# EAGLE design RGB_Bike_POV_v3 (EAGLE 6.1)

## Sheet 1 of 2
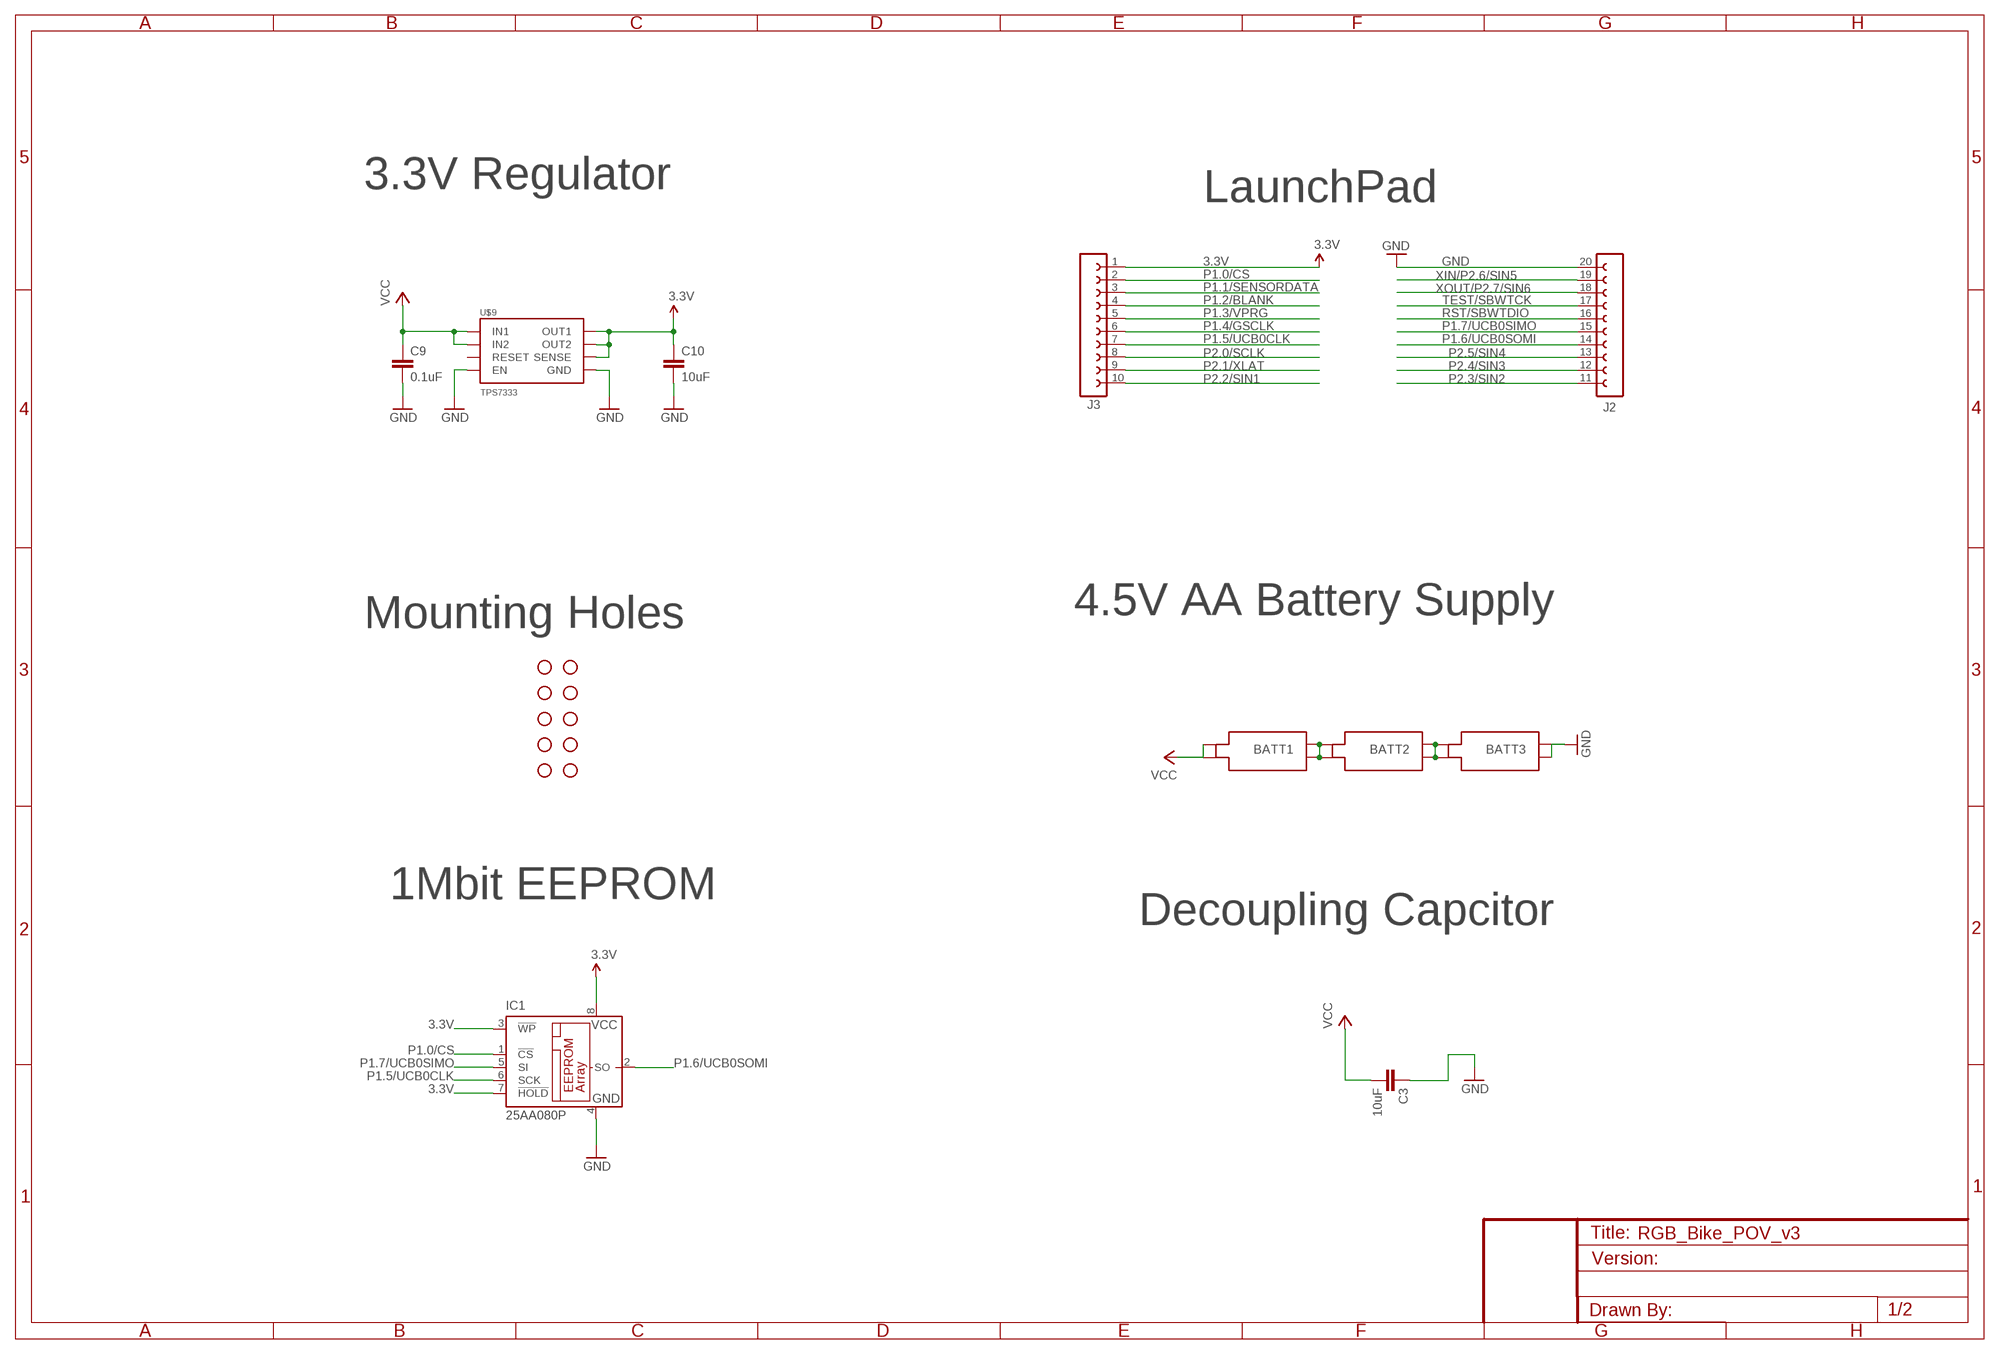
[diagram p0: schematic, sheet 1]

### Parts
BATT1  1XAA  [1XAA]
BATT2  1XAA  [1XAA]
BATT3  1XAA  [1XAA]
C3  10uF  CAPPTH  [CAP-PTH-SMALL]
C9  0.1uF  CAPPTH  [CAP-PTH-SMALL]
C10  10uF  CAPPTH  [CAP-PTH-SMALL]
IC1  25AA080P  [DIL8]
J2  FE10H  [FE10H]
J3  FE10L  [FE10]
JP1  STAND-OFF  [STAND-OFF]
JP2  STAND-OFF  [STAND-OFF]
JP3  STAND-OFF  [STAND-OFF]
JP4  STAND-OFF  [STAND-OFF]
JP5  STAND-OFF  [STAND-OFF]
JP7  STAND-OFF  [STAND-OFF]
JP25  STAND-OFF  [STAND-OFF]
JP26  STAND-OFF  [STAND-OFF]
JP27  STAND-OFF  [STAND-OFF]
JP28  STAND-OFF  [STAND-OFF]
U$9  TPS7333  [TPS7333]

### Nets
3.3V: C10.1 IC1.3(!WP) IC1.7(!HOLD) IC1.8(VCC) J3.1 U$9.5(OUT1) U$9.6(OUT2) U$9.7(SENSE) ; also sheet 2
GND: BATT3.N1 BATT3.N2 C3.1 C9.2 C10.2 IC1.4(GND) J2.20 U$9.1(GND) U$9.2(EN) ; also sheet 2
N$21: BATT1.N1 BATT1.N2 BATT2.P1 BATT2.P2
N$22: BATT2.N1 BATT2.N2 BATT3.P1 BATT3.P2
P1.0/CS: IC1.1(!CS) J3.2
P1.1/SENSORDATA: J3.3 ; also sheet 2
P1.2/BLANK: J3.4 ; also sheet 2
P1.3/VPRG: J3.5 ; also sheet 2
P1.4/GSCLK: J3.6 ; also sheet 2
P1.5/UCB0CLK: IC1.6(SCK) J3.7
P1.6/UCB0SOMI: IC1.2(SO) J2.14
P1.7/UCB0SIMO: IC1.5(SI) J2.15
P2.0/SCLK: J3.8 ; also sheet 2
P2.1/XLAT: J3.9 ; also sheet 2
P2.2/SIN1: J3.10 ; also sheet 2
P2.3/SIN2: J2.11 ; also sheet 2
P2.4/SIN3: J2.12 ; also sheet 2
P2.5/SIN4: J2.13 ; also sheet 2
RST/SBWTDIO: J2.16
TEST/SBWTCK: J2.17
VCC: BATT1.P1 BATT1.P2 C3.2 C9.1 U$9.3(IN1) U$9.4(IN2) ; also sheet 2
XIN/P2.6/SIN5: J2.19 ; also sheet 2
XOUT/P2.7/SIN6: J2.18 ; also sheet 2
Unconnected: U$9.8(RESET)

### Notes on the sheet
- 3.3V Regulator | LaunchPad
- Mounting Holes | 4.5V AA Battery Supply
- 1Mbit EEPROM
- Decoupling Capcitor

## Sheet 2 of 2
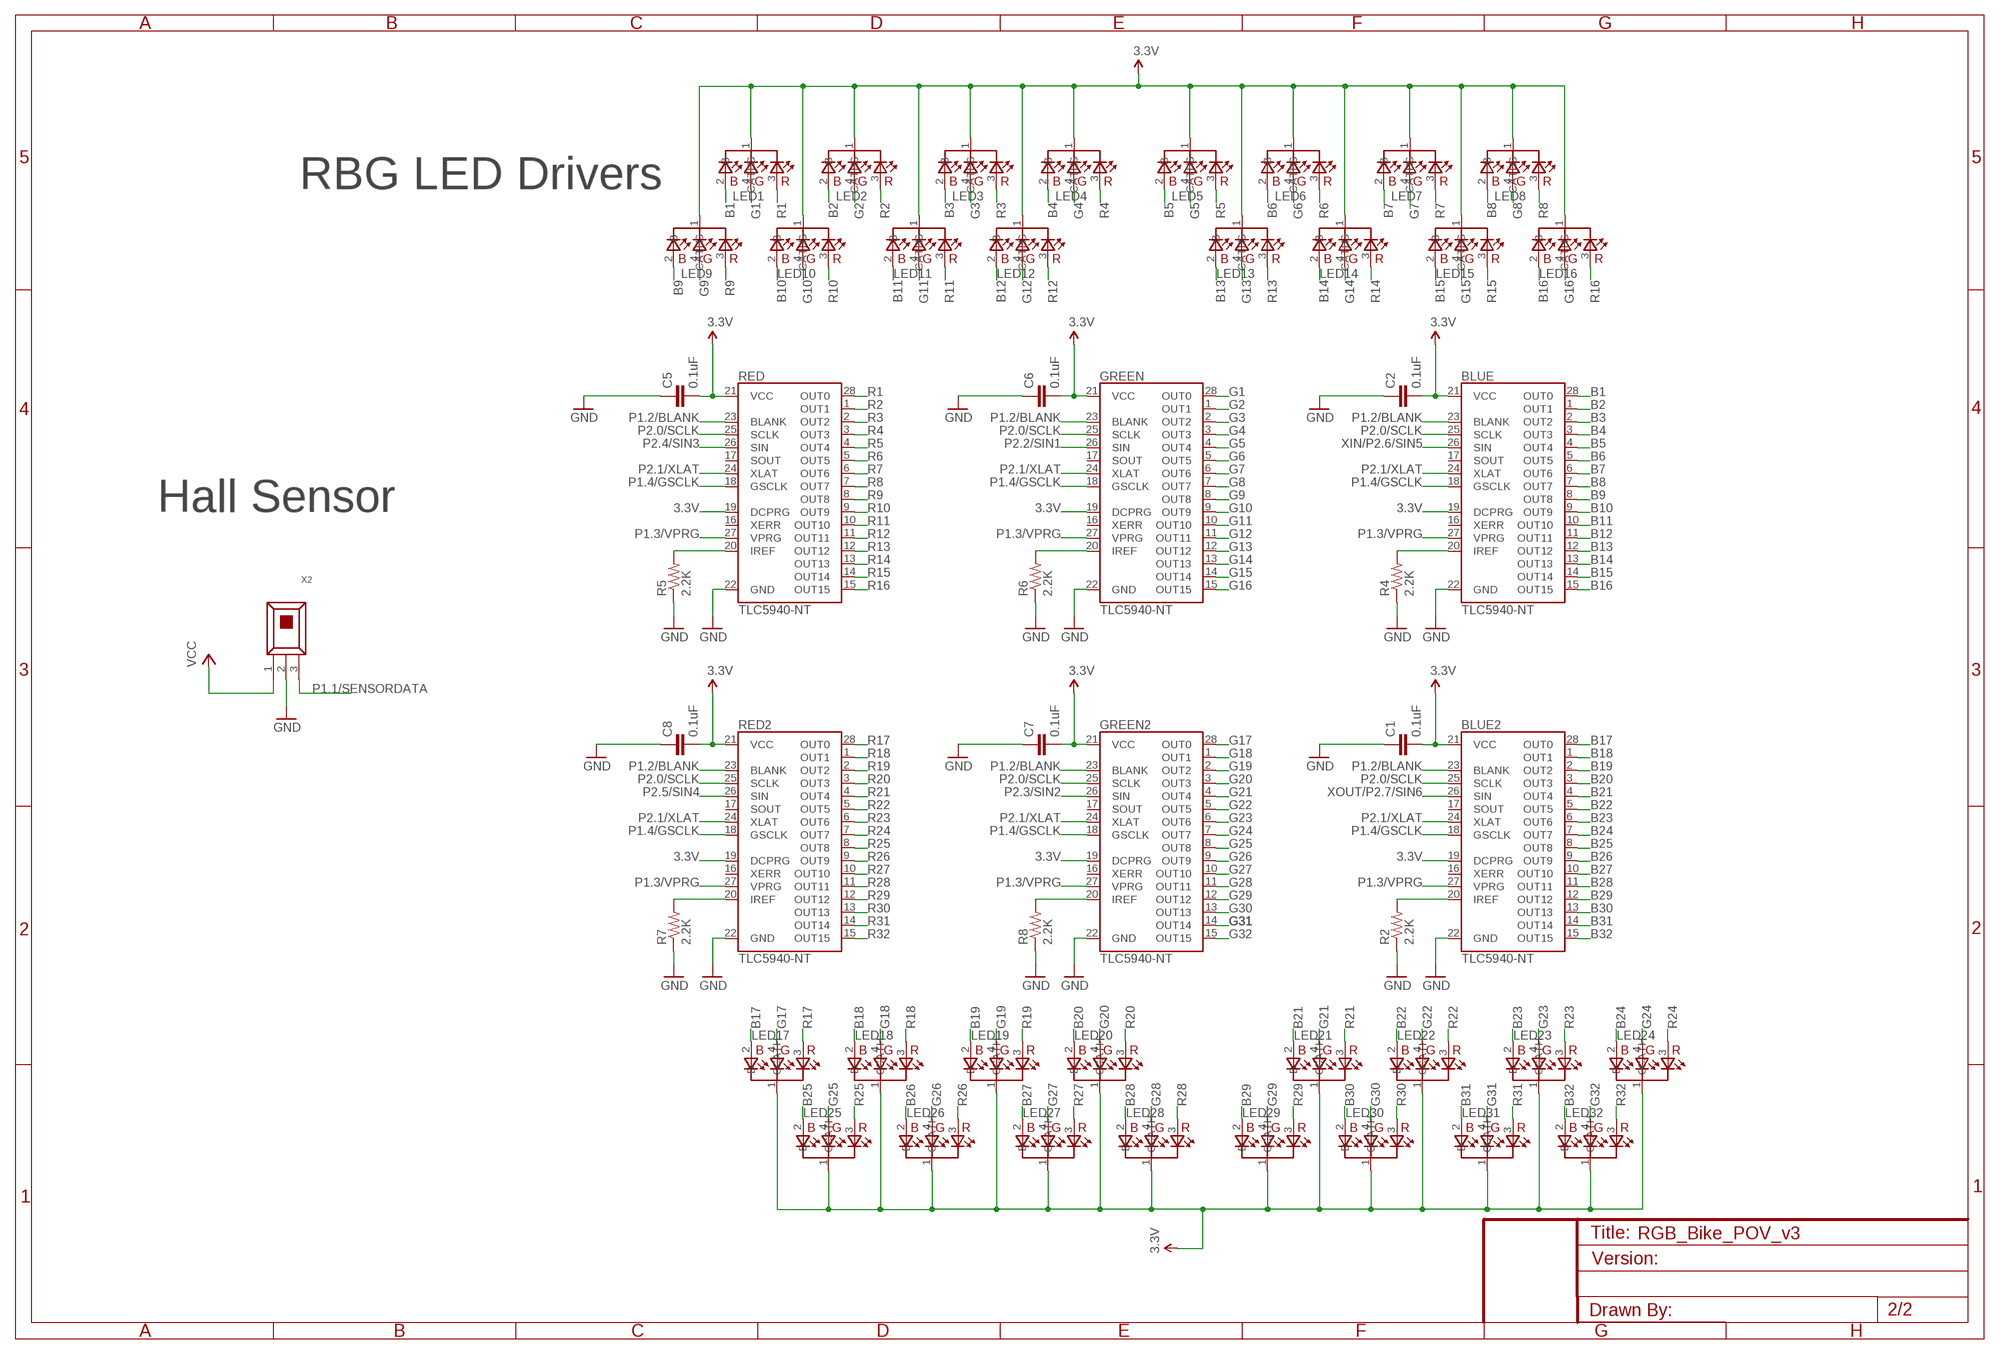
[diagram p1: schematic, sheet 2]

### Parts
BLUE  TLC5940-NT  [DIL28-3]
BLUE2  TLC5940-NT  [DIL28-3]
C1  0.1uF  CAPPTH  [CAP-PTH-SMALL]
C2  0.1uF  CAPPTH  [CAP-PTH-SMALL]
C5  0.1uF  CAPPTH  [CAP-PTH-SMALL]
C6  0.1uF  CAPPTH  [CAP-PTH-SMALL]
C7  0.1uF  CAPPTH  [CAP-PTH-SMALL]
C8  0.1uF  CAPPTH  [CAP-PTH-SMALL]
GREEN  TLC5940-NT  [DIL28-3]
GREEN2  TLC5940-NT  [DIL28-3]
LED1  LED_SUPERFLUX_RGB_CATH  [LED_SUPERFLUX]
LED2  LED_SUPERFLUX_RGB_CATH  [LED_SUPERFLUX]
LED3  LED_SUPERFLUX_RGB_CATH  [LED_SUPERFLUX]
LED4  LED_SUPERFLUX_RGB_CATH  [LED_SUPERFLUX]
LED5  LED_SUPERFLUX_RGB_CATH  [LED_SUPERFLUX]
LED6  LED_SUPERFLUX_RGB_CATH  [LED_SUPERFLUX]
LED7  LED_SUPERFLUX_RGB_CATH  [LED_SUPERFLUX]
LED8  LED_SUPERFLUX_RGB_CATH  [LED_SUPERFLUX]
LED9  LED_SUPERFLUX_RGB_CATH  [LED_SUPERFLUX]
LED10  LED_SUPERFLUX_RGB_CATH  [LED_SUPERFLUX]
LED11  LED_SUPERFLUX_RGB_CATH  [LED_SUPERFLUX]
LED12  LED_SUPERFLUX_RGB_CATH  [LED_SUPERFLUX]
LED13  LED_SUPERFLUX_RGB_CATH  [LED_SUPERFLUX]
LED14  LED_SUPERFLUX_RGB_CATH  [LED_SUPERFLUX]
LED15  LED_SUPERFLUX_RGB_CATH  [LED_SUPERFLUX]
LED16  LED_SUPERFLUX_RGB_CATH  [LED_SUPERFLUX]
LED17  LED_SUPERFLUX_RGB_CATH  [LED_SUPERFLUX]
LED18  LED_SUPERFLUX_RGB_CATH  [LED_SUPERFLUX]
LED19  LED_SUPERFLUX_RGB_CATH  [LED_SUPERFLUX]
LED20  LED_SUPERFLUX_RGB_CATH  [LED_SUPERFLUX]
LED21  LED_SUPERFLUX_RGB_CATH  [LED_SUPERFLUX]
LED22  LED_SUPERFLUX_RGB_CATH  [LED_SUPERFLUX]
LED23  LED_SUPERFLUX_RGB_CATH  [LED_SUPERFLUX]
LED24  LED_SUPERFLUX_RGB_CATH  [LED_SUPERFLUX]
LED25  LED_SUPERFLUX_RGB_CATH  [LED_SUPERFLUX]
LED26  LED_SUPERFLUX_RGB_CATH  [LED_SUPERFLUX]
LED27  LED_SUPERFLUX_RGB_CATH  [LED_SUPERFLUX]
LED28  LED_SUPERFLUX_RGB_CATH  [LED_SUPERFLUX]
LED29  LED_SUPERFLUX_RGB_CATH  [LED_SUPERFLUX]
LED30  LED_SUPERFLUX_RGB_CATH  [LED_SUPERFLUX]
LED31  LED_SUPERFLUX_RGB_CATH  [LED_SUPERFLUX]
LED32  LED_SUPERFLUX_RGB_CATH  [LED_SUPERFLUX]
R2  2.2K  RESISTORPTH-1/6W  [1/6W-RES]
R4  2.2K  RESISTORPTH-1/6W  [1/6W-RES]
R5  2.2K  RESISTORPTH-1/6W  [1/6W-RES]
R6  2.2K  RESISTORPTH-1/6W  [1/6W-RES]
R7  2.2K  RESISTORPTH-1/6W  [1/6W-RES]
R8  2.2K  RESISTORPTH-1/6W  [1/6W-RES]
RED  TLC5940-NT  [DIL28-3]
RED2  TLC5940-NT  [DIL28-3]
X2  HALLEFFECT  [3SIP]

### Nets
3.3V: BLUE2.19(DCPRG) BLUE2.21(VCC) BLUE.19(DCPRG) BLUE.21(VCC) C1.2 C2.2 C5.2 C6.2 C7.2 C8.2 GREEN2.19(DCPRG) GREEN2.21(VCC) GREEN.19(DCPRG) GREEN.21(VCC) LED1.1(CATH) LED2.1(CATH) LED3.1(CATH) LED4.1(CATH) LED5.1(CATH) LED6.1(CATH) LED7.1(CATH) LED8.1(CATH) LED9.1(CATH) LED10.1(CATH) LED11.1(CATH) LED12.1(CATH) LED13.1(CATH) LED14.1(CATH) LED15.1(CATH) LED16.1(CATH) LED17.1(CATH) LED18.1(CATH) LED19.1(CATH) LED20.1(CATH) LED21.1(CATH) LED22.1(CATH) LED23.1(CATH) LED24.1(CATH) LED25.1(CATH) LED26.1(CATH) LED27.1(CATH) LED28.1(CATH) LED29.1(CATH) LED30.1(CATH) LED31.1(CATH) LED32.1(CATH) RED2.19(DCPRG) RED2.21(VCC) RED.19(DCPRG) RED.21(VCC) ; also sheet 1
B1: BLUE.28(OUT0) LED1.2(B)
B2: BLUE.1(OUT1) LED2.2(B)
B3: BLUE.2(OUT2) LED3.2(B)
B4: BLUE.3(OUT3) LED4.2(B)
B5: BLUE.4(OUT4) LED5.2(B)
B6: BLUE.5(OUT5) LED6.2(B)
B7: BLUE.6(OUT6) LED7.2(B)
B8: BLUE.7(OUT7) LED8.2(B)
B9: BLUE.8(OUT8) LED9.2(B)
B10: BLUE.9(OUT9) LED10.2(B)
B11: BLUE.10(OUT10) LED11.2(B)
B12: BLUE.11(OUT11) LED12.2(B)
B13: BLUE.12(OUT12) LED13.2(B)
B14: BLUE.13(OUT13) LED14.2(B)
B15: BLUE.14(OUT14) LED15.2(B)
B16: BLUE.15(OUT15) LED16.2(B)
B17: BLUE2.28(OUT0) LED17.2(B)
B18: BLUE2.1(OUT1) LED18.2(B)
B19: BLUE2.2(OUT2) LED19.2(B)
B20: BLUE2.3(OUT3) LED20.2(B)
B21: BLUE2.4(OUT4) LED21.2(B)
B22: BLUE2.5(OUT5) LED22.2(B)
B23: BLUE2.6(OUT6) LED23.2(B)
B24: BLUE2.7(OUT7) LED24.2(B)
B25: BLUE2.8(OUT8) LED25.2(B)
B26: BLUE2.9(OUT9) LED26.2(B)
B27: BLUE2.10(OUT10) LED27.2(B)
B28: BLUE2.11(OUT11) LED28.2(B)
B29: BLUE2.12(OUT12) LED29.2(B)
B30: BLUE2.13(OUT13) LED30.2(B)
B31: BLUE2.14(OUT14) LED31.2(B)
B32: BLUE2.15(OUT15) LED32.2(B)
G1: GREEN.28(OUT0) LED1.4(G)
G2: GREEN.1(OUT1) LED2.4(G)
G3: GREEN.2(OUT2) LED3.4(G)
G4: GREEN.3(OUT3) LED4.4(G)
G5: GREEN.4(OUT4) LED5.4(G)
G6: GREEN.5(OUT5) LED6.4(G)
G7: GREEN.6(OUT6) LED7.4(G)
G8: GREEN.7(OUT7) LED8.4(G)
G9: GREEN.8(OUT8) LED9.4(G)
G10: GREEN.9(OUT9) LED10.4(G)
G11: GREEN.10(OUT10) LED11.4(G)
G12: GREEN.11(OUT11) LED12.4(G)
G13: GREEN.12(OUT12) LED13.4(G)
G14: GREEN.13(OUT13) LED14.4(G)
G15: GREEN.14(OUT14) LED15.4(G)
G16: GREEN.15(OUT15) LED16.4(G)
G17: GREEN2.28(OUT0) LED17.4(G)
G18: GREEN2.1(OUT1) LED18.4(G)
G19: GREEN2.2(OUT2) LED19.4(G)
G20: GREEN2.3(OUT3) LED20.4(G)
G21: GREEN2.4(OUT4) LED21.4(G)
G22: GREEN2.5(OUT5) LED22.4(G)
G23: GREEN2.6(OUT6) LED23.4(G)
G24: GREEN2.7(OUT7) LED24.4(G)
G25: GREEN2.8(OUT8) LED25.4(G)
G26: GREEN2.9(OUT9) LED26.4(G)
G27: GREEN2.10(OUT10) LED27.4(G)
G28: GREEN2.11(OUT11) LED28.4(G)
G29: GREEN2.12(OUT12) LED29.4(G)
G30: GREEN2.13(OUT13) LED30.4(G)
G31: GREEN2.14(OUT14) LED31.4(G)
G32: GREEN2.15(OUT15) LED32.4(G)
GND: BLUE2.22(GND) BLUE.22(GND) C1.1 C2.1 C5.1 C6.1 C7.1 C8.1 GREEN2.22(GND) GREEN.22(GND) R2.1 R4.1 R5.1 R6.1 R7.1 R8.1 RED2.22(GND) RED.22(GND) X2.2 ; also sheet 1
N$18: BLUE2.20(IREF) R2.2
N$58: BLUE.20(IREF) R4.2
N$77: R5.2 RED.20(IREF)
N$96: GREEN.20(IREF) R6.2
N$115: R7.2 RED2.20(IREF)
N$134: GREEN2.20(IREF) R8.2
P1.1/SENSORDATA: X2.3 ; also sheet 1
P1.2/BLANK: BLUE2.23(BLANK) BLUE.23(BLANK) GREEN2.23(BLANK) GREEN.23(BLANK) RED2.23(BLANK) RED.23(BLANK) ; also sheet 1
P1.3/VPRG: BLUE2.27(VPRG) BLUE.27(VPRG) GREEN2.27(VPRG) GREEN.27(VPRG) RED2.27(VPRG) RED.27(VPRG) ; also sheet 1
P1.4/GSCLK: BLUE2.18(GSCLK) BLUE.18(GSCLK) GREEN2.18(GSCLK) GREEN.18(GSCLK) RED2.18(GSCLK) RED.18(GSCLK) ; also sheet 1
P2.0/SCLK: BLUE2.25(SCLK) BLUE.25(SCLK) GREEN2.25(SCLK) GREEN.25(SCLK) RED2.25(SCLK) RED.25(SCLK) ; also sheet 1
P2.1/XLAT: BLUE2.24(XLAT) BLUE.24(XLAT) GREEN2.24(XLAT) GREEN.24(XLAT) RED2.24(XLAT) RED.24(XLAT) ; also sheet 1
P2.2/SIN1: GREEN.26(SIN) ; also sheet 1
P2.3/SIN2: GREEN2.26(SIN) ; also sheet 1
P2.4/SIN3: RED.26(SIN) ; also sheet 1
P2.5/SIN4: RED2.26(SIN) ; also sheet 1
R1: LED1.3(R) RED.28(OUT0)
R2: LED2.3(R) RED.1(OUT1)
R3: LED3.3(R) RED.2(OUT2)
R4: LED4.3(R) RED.3(OUT3)
R5: LED5.3(R) RED.4(OUT4)
R6: LED6.3(R) RED.5(OUT5)
R7: LED7.3(R) RED.6(OUT6)
R8: LED8.3(R) RED.7(OUT7)
R9: LED9.3(R) RED.8(OUT8)
R10: LED10.3(R) RED.9(OUT9)
R11: LED11.3(R) RED.10(OUT10)
R12: LED12.3(R) RED.11(OUT11)
R13: LED13.3(R) RED.12(OUT12)
R14: LED14.3(R) RED.13(OUT13)
R15: LED15.3(R) RED.14(OUT14)
R16: LED16.3(R) RED.15(OUT15)
R17: LED17.3(R) RED2.28(OUT0)
R18: LED18.3(R) RED2.1(OUT1)
R19: LED19.3(R) RED2.2(OUT2)
R20: LED20.3(R) RED2.3(OUT3)
R21: LED21.3(R) RED2.4(OUT4)
R22: LED22.3(R) RED2.5(OUT5)
R23: LED23.3(R) RED2.6(OUT6)
R24: LED24.3(R) RED2.7(OUT7)
R25: LED25.3(R) RED2.8(OUT8)
R26: LED26.3(R) RED2.9(OUT9)
R27: LED27.3(R) RED2.10(OUT10)
R28: LED28.3(R) RED2.11(OUT11)
R29: LED29.3(R) RED2.12(OUT12)
R30: LED30.3(R) RED2.13(OUT13)
R31: LED31.3(R) RED2.14(OUT14)
R32: LED32.3(R) RED2.15(OUT15)
VCC: X2.1 ; also sheet 1
XIN/P2.6/SIN5: BLUE.26(SIN) ; also sheet 1
XOUT/P2.7/SIN6: BLUE2.26(SIN) ; also sheet 1
Unconnected: BLUE2.16(XERR) BLUE2.17(SOUT) BLUE.16(XERR) BLUE.17(SOUT) GREEN2.16(XERR) GREEN2.17(SOUT) GREEN.16(XERR) GREEN.17(SOUT) RED2.16(XERR) RED2.17(SOUT) RED.16(XERR) RED.17(SOUT)

### Notes on the sheet
- RBG LED Drivers
- Hall Sensor

## Library data of the parts
BATT1-BATT3 = dorky:1XAA
BLUE BLUE2 GREEN GREEN2 RED RED2 = SparkFun:TLC5940: TI TLC5940 16-channel LED Driver with Dot Correction and Grayscale PWM Control The TLC5940 is a 16-channel, constant-current sink LED driver. Each channel has an individually adjustable 4096-step grayscale PWM brightness control and a 64-step, constant-current sink (dot correction). The dot correction adjusts the brightness variations between LED channels and other LED drivers. The dot correction data is stored in an integrated EEPROM. Both grayscale control and dot correction are accessible via a serial interface. A single external resistor sets the maximum current value of all 16 channels. Packages: 28-pin HTSSOP 32-pin 5x5mm QFN 28-pin DIP
C1-C3 C5-C10 = SparkFun:CAP: Capacitor Standard 0603 ceramic capacitor, and 0.1" leaded capacitor.
IC1 = microchip:25*: Serial EEPROM 4K/ 8K , SPI bus; MF: MICROCHIP; MPN: 25AA080/P; OC_FARNELL: 1331352; OC_NEWARK: 92C7349
J2 = sMSP430:FE10H
J3 = sMSP430:FE10L
JP1-JP5 JP7 JP25-JP28 = SparkFun:STAND-OFF: Stand Off This is the mechanical footprint for a #4 phillips button head screw. Use the keepout ring to avoid running the screw head into surrounding components. SKU : PRT-00447
LED1-LED32 = hazard:LED_SUPERFLUX_RGB_CATH
R2 R4-R8 = SparkFun:RESISTOR: Resistor Basic schematic elements and footprints for 0603, 1206, and PTH resistors.
U$9 = launchpad_comp:TPS7333
X2 = dorky:HALLEFFECT

## Net classes
0 default: width 0.254 mm
1 Ground: width 0.1 mm, drill 0.2 mm

## Board
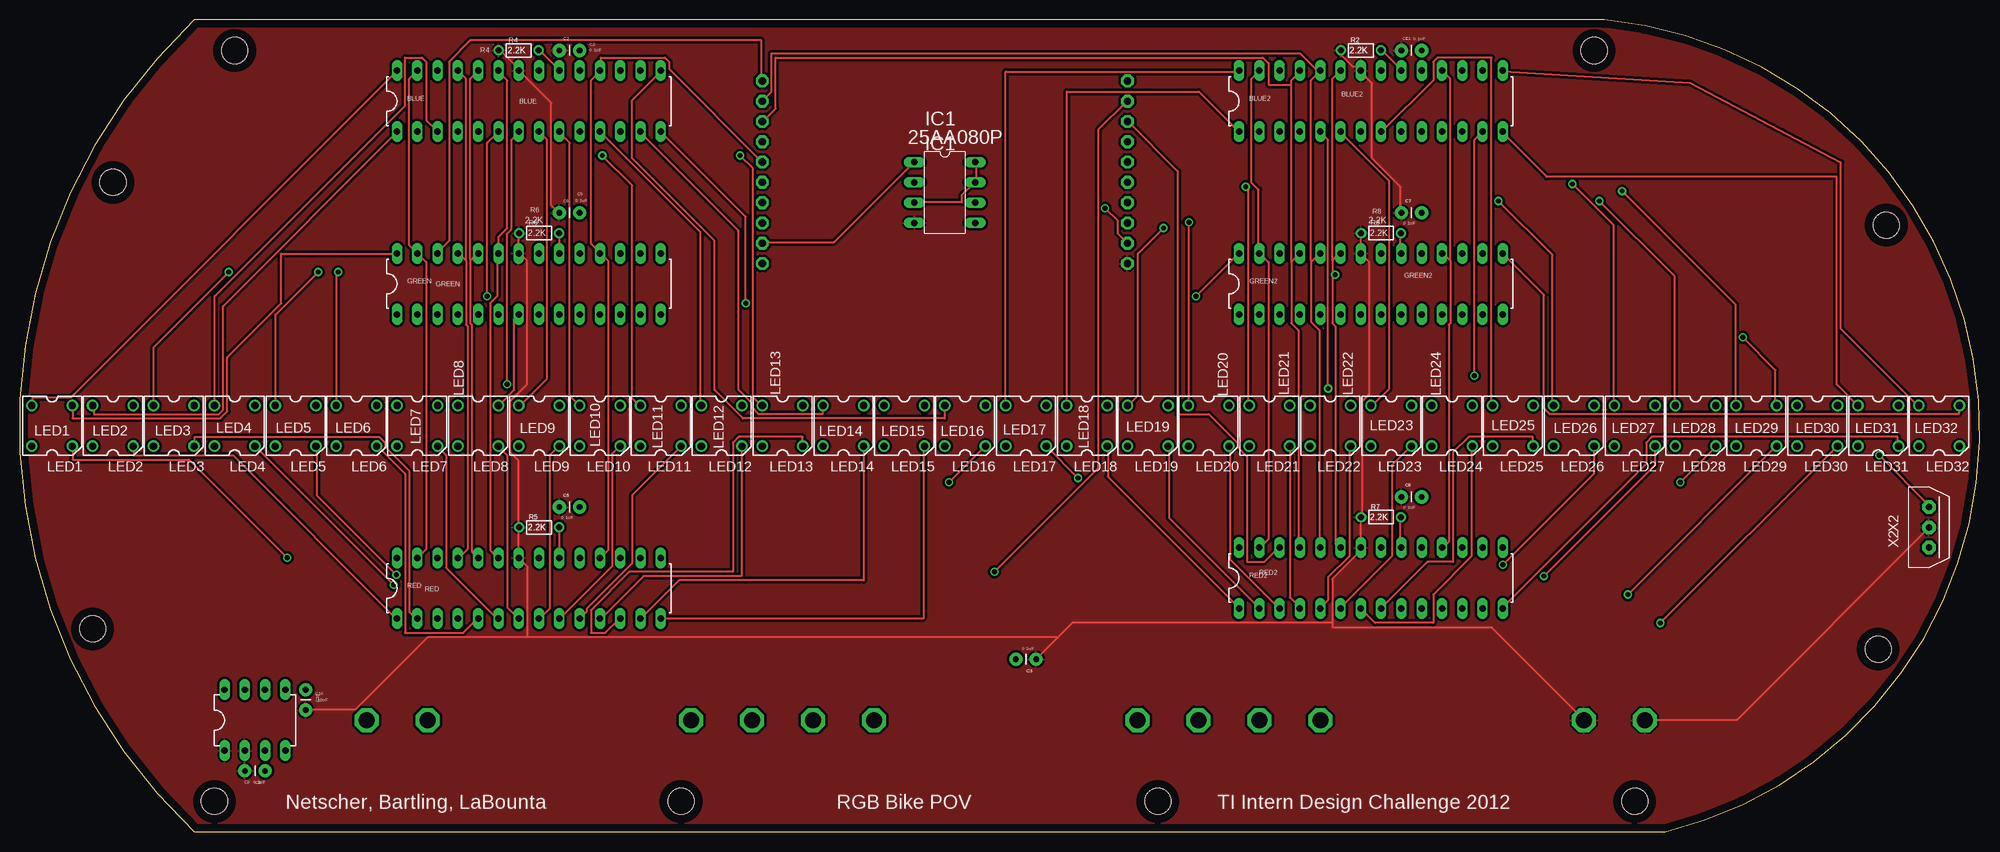
[diagram p2: board, top side]
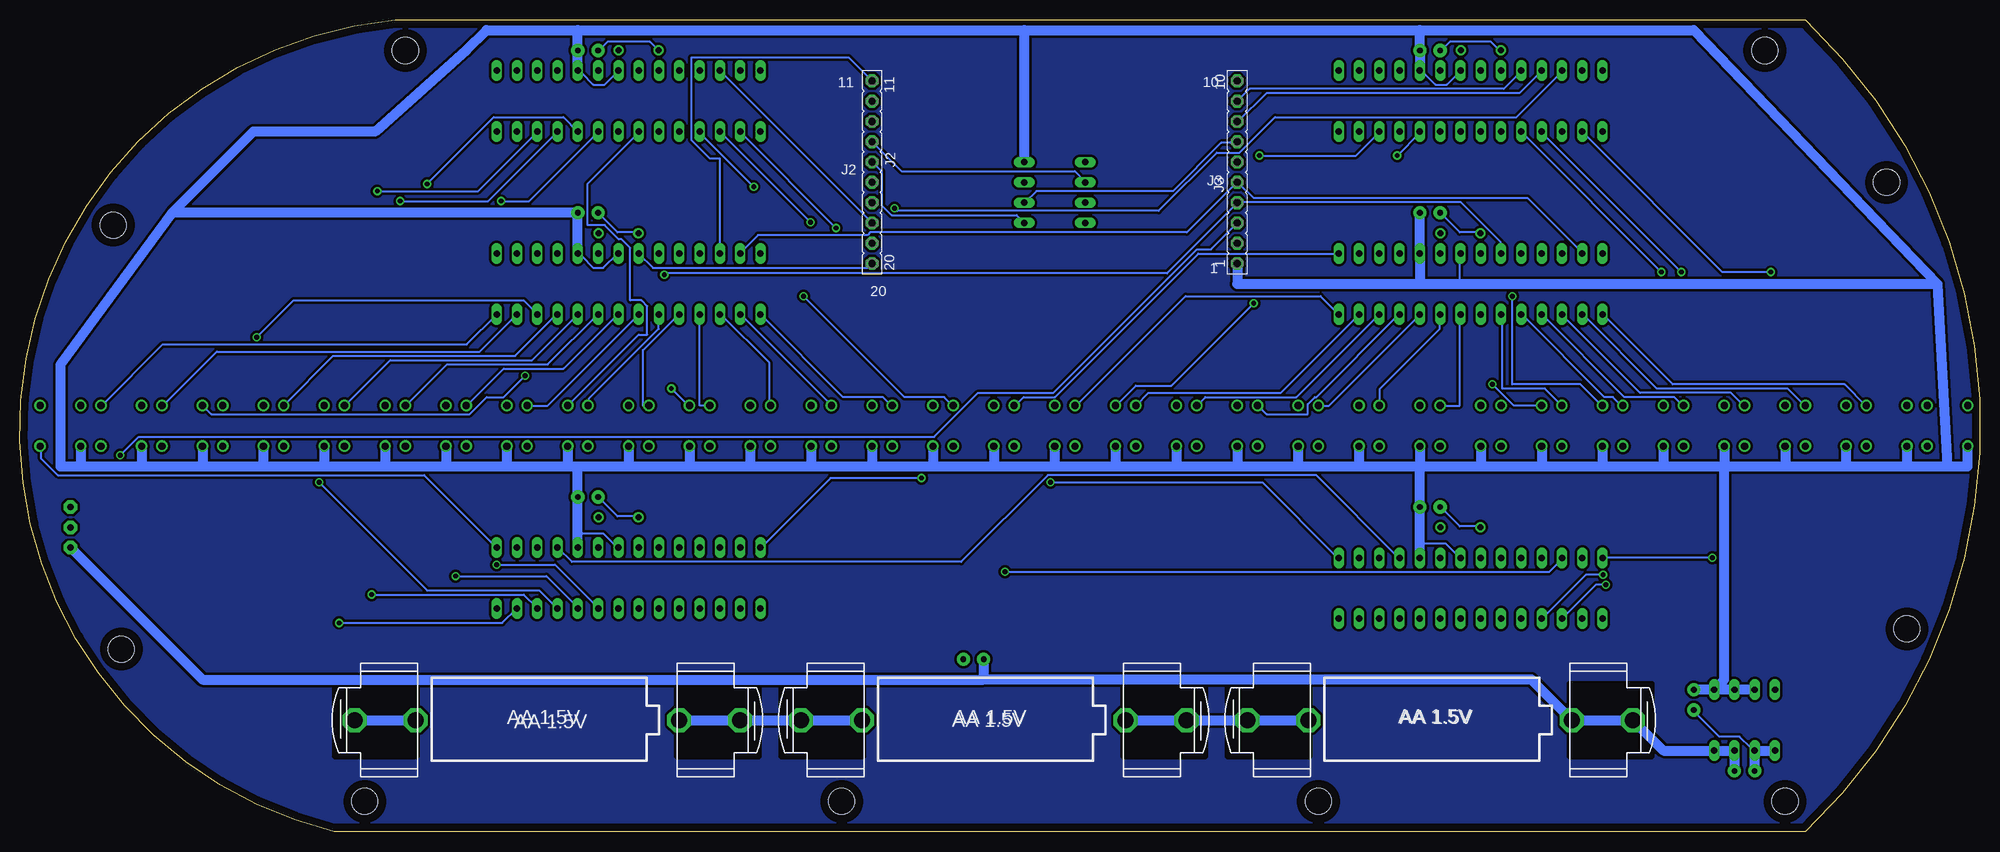
[diagram p3: board, bottom side, seen from below]

Size 245.31 x 101.6 mm. Coordinates in mm from the lower left corner, seen from the top.
Outline: 21.8,0 205.95,0 arc161 198.33,101.6 21.8,101.6 arc93 21.8,0
Copper layers (1*16): Top 0.035mm / dielectric 1.5mm / Bottom 0.035mm
Design rules: minimum track width 10mil, minimum drill 24mil, track to track 8mil, track to pad 8mil, pad to pad 8mil, via to via 8mil, smd to smd 8mil, copper to edge 40mil, drill to drill 8mil, minimum pad ring 10mil, minimum via ring 8mil, stop-mask expansion 4mil, vias tented up to drill 0mil, thermal gap 10mil

### Footprints (pad centres in the part's own frame; a part is rotated, then mirrored left to right if it is on the bottom)
1XAA = drill 2 octagon: N1 -15.24,0; N2 -22.86,0; P1 17.78,0; P2 25.4,0
DIL28-3 = drill 0.813 long: 1 -16.51,-3.81; 2 -13.97,-3.81; 3 -11.43,-3.81; 4 -8.89,-3.81; 5 -6.35,-3.81; 6 -3.81,-3.81; 7 -1.27,-3.81; 8 1.27,-3.81; 9 3.81,-3.81; 10 6.35,-3.81; 11 8.89,-3.81; 12 11.43,-3.81; 13 13.97,-3.81; 14 16.51,-3.81; 15 16.51,3.81; 16 13.97,3.81; 17 11.43,3.81; 18 8.89,3.81; 19 6.35,3.81; 20 3.81,3.81; 21 1.27,3.81; 22 -1.27,3.81; 23 -3.81,3.81; 24 -6.35,3.81; 25 -8.89,3.81; 26 -11.43,3.81; 27 -13.97,3.81; 28 -16.51,3.81
CAP-PTH-SMALL = drill 0.7 pad 1.651: 1 0,0; 2 2.54,0
DIL8 = drill 0.813 long: 1 -3.81,-3.81; 2 -1.27,-3.81; 3 1.27,-3.81; 4 3.81,-3.81; 5 3.81,3.81; 6 1.27,3.81; 7 -1.27,3.81; 8 -3.81,3.81
FE10H = drill 0.914 pad 1.6 octagon: 11 -11.43,0; 12 -8.89,0; 13 -6.35,0; 14 -3.81,0; 15 -1.27,0; 16 1.27,0; 17 3.81,0; 18 6.35,0; 19 8.89,0; 20 11.43,0
FE10 = drill 0.914 pad 1.6 octagon: 1 -11.43,0; 2 -8.89,0; 3 -6.35,0; 4 -3.81,0; 5 -1.27,0; 6 1.27,0; 7 3.81,0; 8 6.35,0; 9 8.89,0; 10 11.43,0
STAND-OFF = hole 3.302: 0,0
LED_SUPERFLUX = drill 0.9 pad 1.422: 1 0,5.08; 2 5.08,5.08; 3 0,0; 4 5.08,0
1/6W-RES = drill 0.762: 1 -2.5,0; 2 2.5,0
TPS7333 = drill 0.8 long: 1 -3.81,3.81; 2 -3.81,1.27; 3 -3.81,-1.27; 4 -3.81,-3.81; 5 3.81,-3.81; 6 3.81,-1.27; 7 3.81,1.27; 8 3.81,3.81
3SIP = drill 0.813 pad 1.676 octagon: 1 -2.54,0; 2 0,0; 3 2.54,0

### Placement (x,y rotation side)
BATT1  68.79,13.97 0 bottom
BATT2  124.67,13.97 0 bottom
BATT3  180.55,13.97 0 bottom
BLUE  63.71,91.44 0 top
BLUE2  169.12,91.44 0 top
C1  172.93,97.79 0 top
C2  67.52,97.79 0 top
C3  127.21,21.59 180 top
C5  67.52,40.64 0 top
C6  67.52,77.47 0 top
C7  172.93,77.47 0 top
C8  172.93,41.91 0 top
C9  30.69,7.62 180 top
C10  35.77,17.78 270 top
GREEN  63.71,68.58 0 top
GREEN2  169.12,68.58 0 top
IC1  115.78,80.01 270 top
J2  138.64,82.55 270 bottom
J3  92.92,82.55 90 bottom
JP1  82.76,3.81 0 top
JP2  24.34,3.81 0 top
JP3  142.45,3.81 0 top
JP4  202.14,3.81 0 top
JP5  26.88,97.79 0 top
JP7  197.06,97.79 0 top
JP25  232.62,22.86 0 top
JP26  11.64,81.28 0 top
JP27  9.1,25.4 0 top
JP28  233.63,75.92 0 top
LED1  6.56,48.26 90 top
LED2  14.18,48.26 90 top
LED3  21.8,48.26 90 top
LED4  29.42,48.26 90 top
LED5  37.04,48.26 90 top
LED6  44.66,48.26 90 top
LED7  52.28,48.26 90 top
LED8  59.9,48.26 90 top
LED9  67.52,48.26 90 top
LED10  75.14,48.26 90 top
LED11  82.76,48.26 90 top
LED12  90.38,48.26 90 top
LED13  98,48.26 90 top
LED14  105.62,48.26 90 top
LED15  113.24,48.26 90 top
LED16  120.86,48.26 90 top
LED17  128.48,48.26 90 top
LED18  136.1,48.26 90 top
LED19  143.72,48.26 90 top
LED20  151.34,48.26 90 top
LED21  158.96,48.26 90 top
LED22  166.58,48.26 90 top
LED23  174.2,48.26 90 top
LED24  181.82,48.26 90 top
LED25  189.44,48.26 90 top
LED26  197.06,48.26 90 top
LED27  204.68,48.26 90 top
LED28  212.3,48.26 90 top
LED29  219.92,48.26 90 top
LED30  227.54,48.26 90 top
LED31  235.16,48.26 90 top
LED32  242.78,48.26 90 top
R2  167.85,97.79 0 top
R4  62.44,97.79 0 top
R5  64.98,38.1 0 top
R6  64.98,74.93 0 top
R7  170.39,39.37 0 top
R8  170.39,74.93 0 top
RED  63.71,30.48 0 top
RED2  169.12,31.75 0 top
U$9  29.42,13.97 90 top
X2  238.97,38.1 90 top

### Tracks (layer width: path | path; a pad name or v marks a point on that pad's centre or on a via)
3.3V
  Top 0.254: IC1.3 112.02,78.77 117.89,78.77 117.89,79.65 119.49,81.25 IC1.7 119.66,81.43 119.66,83.74 IC1.8
  Bottom 0.254: 70.06,36.09 66.86,36.09 65.08,34.31 RED.21 | 65.08,68.58 65.08,72.36 GREEN.21 | BLUE.21 65.08,95.12 66.68,93.52 68.1,93.52 69.53,94.94 BLUE.19 | 175.47,37.34 172.29,37.34 170.52,35.56 RED2.21 | GREEN2.21 170.52,72.36 172.29,70.59 173.54,70.59 174.96,72.01 GREEN2.19 | BLUE2.21 172.12,93.52 173.54,93.52 174.96,94.94 BLUE2.19
  Bottom 1.27: U$9.7 U$9.6 U$9.5 | U$9.5 C10.1 | U$9.5 31.96,19.05 31.96,45.72 | 31.96,45.72 24.34,45.72 | 24.34,45.72 16.72,45.72 | 16.72,45.72 9.1,45.72 | 9.1,45.72 4.02,45.72 | 4.02,45.72 1.48,45.72 LED1.1 | LED2.1 9.1,45.72 | LED3.1 16.72,45.72 | LED4.1 24.34,45.72 | LED32.1 237.7,45.72 | 237.7,45.72 230.08,45.72 | 230.08,45.72 222.46,45.72 | 222.46,45.72 214.84,45.72 | 214.84,45.72 207.22,45.72 | 207.22,45.72 199.6,45.72 | 199.6,45.72 191.98,45.72 | 191.98,45.72 184.36,45.72 | 184.36,45.72 176.74,45.72 | 176.74,45.72 175.47,45.72 | 175.47,45.72 169.12,45.72 | 169.12,45.72 161.5,45.72 | 161.5,45.72 153.88,45.72 | 153.88,45.72 146.26,45.72 | 146.26,45.72 138.64,45.72 | 138.64,45.72 131.02,45.72 | 131.02,45.72 123.4,45.72 | 123.4,45.72 115.78,45.72 | 115.78,45.72 108.16,45.72 | 108.16,45.72 100.54,45.72 | 100.54,45.72 92.92,45.72 | 92.92,45.72 85.3,45.72 | 85.3,45.72 77.68,45.72 | 77.68,45.72 70.06,45.72 | 70.06,45.72 62.44,45.72 | 62.44,45.72 54.82,45.72 | 54.82,45.72 47.2,45.72 | 47.2,45.72 39.58,45.72 | 39.58,45.72 31.96,45.72 | LED5.1 31.96,45.72 | LED6.1 39.58,45.72 | LED7.1 47.2,45.72 | LED8.1 54.82,45.72 | LED9.1 62.44,45.72 | LED10.1 70.06,45.72 | LED11.1 77.68,45.72 | LED12.1 85.3,45.72 | LED13.1 92.92,45.72 | LED14.1 100.54,45.72 | LED15.1 108.16,45.72 | LED16.1 115.78,45.72 | LED17.1 123.4,45.72 | LED18.1 131.02,45.72 | LED19.1 138.64,45.72 | LED20.1 146.26,45.72 | LED21.1 153.88,45.72 | LED22.1 161.5,45.72 | LED23.1 169.12,45.72 | LED24.1 176.74,45.72 | LED25.1 184.36,45.72 | LED26.1 191.98,45.72 | LED27.1 199.6,45.72 | LED28.1 207.22,45.72 | LED29.1 214.84,45.72 | LED30.1 222.46,45.72 | LED31.1 230.08,45.72 | RED.19 70.06,36.09 C5.2 70.06,45.72 | C6.2 GREEN.19 70.06,68.58 | RED2.19 175.47,37.34 C8.2 175.47,45.72
  Bottom 1.27: GREEN2.19 C7.2 226.27,77.47 | BLUE.19 C2.2 70.06,100.33 | 119.59,100.33 IC1.8 | 226.27,77.47 240.24,58.42 240.24,45.72 237.7,45.72 | 226.27,77.47 216.11,87.63 200.87,87.63 189.44,97.79 186.9,100.33 175.47,100.33 | BLUE2.19 C1.2 175.47,100.33 | 175.47,100.33 119.59,100.33 | 119.59,100.33 70.06,100.33 | 70.06,100.33 35.77,100.33 5.29,68.58 | 5.29,68.58 4.02,45.72 | 70.06,68.58 65.08,68.58 5.29,68.58 | J3.1 92.92,68.58 70.06,68.58
B1
  Top 0.254: BLUE.28 47.12,95.12 6.41,54.41 1.61,54.41 1.61,53.34 LED1.2
B2
  Top 0.254: BLUE.1 47.12,87.48 25.43,65.79 25.43,52.81 24.9,52.27 9.25,52.27 9.25,53.34 LED2.2
B3  (via drill 0.61)
  Top 0.254: v26.14,70.05 16.72,60.63 LED3.2
  Bottom 0.254: v26.14,70.05 32.19,70.05 49.61,87.48 BLUE.2
B4
  Top 0.254: BLUE.3 52.28,87.66 50.86,89.08 50.86,96.37 50.32,96.9 48.19,96.9 48.19,90.86 24.36,67.03 24.36,53.34 LED4.2
B5  (via drill 0.61)
  Top 0.254: v37.34,70.05 32.01,64.72 32.01,53.34 LED5.2
  Bottom 0.254: v37.34,70.05 54.77,87.48 BLUE.4
B6  (via drill 0.61)
  Top 0.254: v39.83,70.05 39.65,69.88 39.65,53.34 LED6.2
  Bottom 0.254: v39.83,70.05 57.26,87.48 BLUE.5
B7  (via drill 0.61)
  Top 0.254: BLUE.6 58.5,86.23 v58.5,67.03
  Bottom 0.254: v58.5,67.03 58.5,56.01 49.97,56.01 47.3,53.34 LED7.2
B8  (via drill 0.61)
  Top 0.254: v60.99,56.01 60.99,74.85 61.52,75.39 61.52,86.59 62.41,87.48 BLUE.7
  Bottom 0.254: v60.99,56.01 58.32,53.34 LED8.2
B9
  Top 0.254: BLUE.8 65.08,87.48 65.97,86.59 65.97,56.72 62.59,53.34 LED9.2
B10
  Top 0.254: LED10.2 68.81,54.59 68.81,86.23 67.57,87.48 BLUE.9
B11  (via drill 0.61)
  Top 0.254: v72.9,84.63 76.64,80.9 76.64,54.23 77.53,53.34 LED11.2
  Bottom 0.254: v72.9,84.63 70.06,87.48 BLUE.10
B12
  Top 0.254: BLUE.11 72.73,87.48 85.17,75.03 85.17,53.34 LED12.2
B13  (via drill 0.61)
  Top 0.254: v90.15,84.63 91.75,83.03 91.75,54.41 92.82,53.34 LED13.2
  Bottom 0.254: v90.15,84.63 78.06,84.63 75.21,87.48 BLUE.12
B14
  Top 0.254: BLUE.13 77.7,87.48 89.97,75.21 89.97,55.3 91.75,53.52 91.75,52.98 92.46,52.27 100.46,52.27 100.46,53.34 LED14.2
B15  (via drill 0.61)
  Top 0.254: BLUE.14 90.86,76.99 v90.86,66.14
  Bottom 0.254: v90.86,66.14 101.17,55.83 105.62,55.83 108.11,53.34 LED15.2
B16
  Top 0.254: BLUE.15 80.19,95.12 76.64,91.57 76.64,84.28 86.95,73.97 86.95,55.3 90.51,51.74 115.75,51.74 115.75,53.34 LED16.2
B17
  Top 0.254: LED17.2 123.4,95.12 152.56,95.12 BLUE2.28
B18
  Top 0.254: BLUE2.1 152.56,87.66 147.58,92.63 131.04,92.63 131.04,53.34 LED18.2
B19  (via drill 0.61)
  Top 0.254: v143.13,75.56 139.93,72.36 139.93,54.59 138.69,53.34 LED19.2
  Bottom 0.254: v143.13,75.56 155.05,87.48 BLUE2.2
B20  (via drill 0.61)
  Top 0.254: v146.33,76.28 146.33,53.34 LED20.2
  Bottom 0.254: v146.33,76.28 BLUE2.3
B21  (via drill 0.61)
  Top 0.254: v153.45,80.72 153.8,80.37 153.8,53.34 LED21.2
  Bottom 0.254: v153.45,80.72 160.2,87.48 BLUE2.4
B22  (via drill 0.61)
  Top 0.254: v163.76,55.47 163.76,86.59 162.87,87.48 BLUE2.5
  Bottom 0.254: v163.76,55.47 161.63,53.34 LED22.2
B23
  Top 0.254: BLUE2.6 165.36,87.48 171.4,81.43 171.4,55.47 169.27,53.34 LED23.2
B24
  Bottom 0.254: LED24.2 167.85,62.23 166.78,62.23 166.78,65.79 167.49,66.5 168.92,66.5 168.92,73.08 169.98,74.14 170.34,74.14 172.12,75.92 174.25,75.92 174.25,81.08 167.85,87.48 BLUE2.7
B25
  Top 0.254: BLUE2.8 170.52,87.66 176.92,94.06 176.92,96.37 177.45,96.9 184.21,96.9 184.21,53.34 LED25.2
B26  (via drill 0.61)
  Top 0.254: v185.1,78.94 191.85,72.19 191.85,53.34 LED26.2
  Bottom 0.254: v185.1,78.94 181.54,78.94 173,87.48 BLUE2.9
B27  (via drill 0.61)
  Top 0.254: v194.34,81.08 199.5,75.92 199.5,53.34 LED27.2
  Bottom 0.254: BLUE2.10 177.27,89.43 185.98,89.43 v194.34,81.08
B28  (via drill 0.61)
  Top 0.254: v197.72,78.94 207.14,69.52 207.14,53.34 LED28.2
  Bottom 0.254: BLUE2.11 186.7,78.94 v197.72,78.94
B29  (via drill 0.61)
  Top 0.254: v200.56,80.19 214.79,65.96 214.79,53.34 LED29.2
  Bottom 0.254: v200.56,80.19 187.94,80.19 180.65,87.48 BLUE2.12
B30  (via drill 0.61)
  Top 0.254: v182.07,57.07 182.07,86.59 182.96,87.48 BLUE2.13
  Bottom 0.254: v182.07,57.07 184.74,54.41 186.87,54.41 189.01,52.27 221.37,52.27 222.43,53.34 LED30.2
B31
  Top 0.254: LED31.2 227.41,56.01 227.41,81.97 191.14,81.97 185.63,87.48 BLUE2.14
B32
  Top 0.254: BLUE2.15 185.63,95.12 209.1,93.7 227.94,83.74 227.94,62.94 237.55,53.34 LED32.2
G1
  Top 0.254: GREEN.28 47.12,72.36 32.72,72.36 32.72,66.14 25.96,59.38 25.96,52.63 25.08,51.74 6.58,51.74 6.58,53.34 LED1.4
G2
  Bottom 0.254: GREEN.1 47.12,64.72 38.41,56.01 16.9,56.01 14.23,53.34 LED2.4
G3
  Bottom 0.254: GREEN.2 49.61,64.72 40.37,55.47 24.01,55.47 21.87,53.34 LED3.4
G4
  Bottom 0.254: GREEN.3 52.28,64.72 42.5,54.94 31.12,54.94 29.52,53.34 LED4.4
G5
  Bottom 0.254: GREEN.4 44.46,54.41 38.23,54.41 37.17,53.34 LED5.4
G6
  Bottom 0.254: GREEN.5 57.26,64.72 46.94,54.41 45.88,54.41 44.81,53.34 LED6.4
G7
  Bottom 0.254: LED7.4 54.41,55.47 59.75,55.47 59.75,64.72 GREEN.6
G8
  Top 0.254: GREEN.7 62.41,64.72 61.88,64.19 61.88,55.3 59.92,53.34 LED8.4
G9
  Bottom 0.254: LED9.4 65.08,53.34 65.08,64.72 GREEN.8
G10
  Bottom 0.254: GREEN.9 67.57,64.72 67.57,62.94 75.04,55.47 75.04,53.34 LED10.4
G11
  Bottom 0.254: LED11.4 81.44,53.34 70.06,64.72 GREEN.10
G12
  Bottom 0.254: GREEN.11 72.73,64.72 83.04,54.41 83.22,54.41 84.1,53.52 84.1,52.27 89.26,52.27 90.33,53.34 LED12.4
G13
  Bottom 0.254: GREEN.12 75.21,64.72 85.53,54.41 96.91,54.41 97.97,53.34 LED13.4
G14
  Bottom 0.254: LED14.4 104.02,54.94 87.48,54.94 77.7,64.72 GREEN.13
G15
  Bottom 0.254: GREEN.14 80.37,64.9 82.5,67.03 99.4,67.03 113.09,53.34 LED15.4
G16
  Bottom 0.254: GREEN.15 80.37,72.36 97.8,72.36 115.75,54.41 119.66,54.41 120.73,53.34 LED16.4
G17  (via drill 0.61)
  Top 0.254: v147.22,67.03 152.56,72.36 GREEN2.28
  Bottom 0.254: v147.22,67.03 134.6,54.41 129.62,54.41 128.55,53.34 LED17.4
G18
  Bottom 0.254: GREEN2.1 142.25,54.41 137.27,54.41 136.2,53.34 LED18.4
G19
  Bottom 0.254: GREEN2.2 155.05,64.72 143.67,53.34 LED19.4
G20
  Bottom 0.254: GREEN2.3 157.54,64.72 151.49,58.67 151.49,53.34 LED20.4
G21
  Bottom 0.254: LED21.4 160.2,53.34 160.2,64.72 GREEN2.4
G22
  Bottom 0.254: LED22.4 167.32,53.34 167.32,60.27 162.87,64.72 GREEN2.5
G23
  Bottom 0.254: GREEN2.6 165.36,64.72 165.36,62.94 174.07,54.23 174.07,53.34 LED23.4
G24
  Bottom 0.254: LED24.4 179.23,53.34 167.85,64.72 GREEN2.7
G25
  Bottom 0.254: GREEN2.8 170.52,64.72 177.27,57.96 184.74,57.96 189.36,53.34 LED25.4
G26
  Bottom 0.254: GREEN2.9 173,64.72 179.23,58.5 191.85,58.5 197.01,53.34 LED26.4
G27
  Bottom 0.254: GREEN2.10 175.49,64.72 181.18,59.03 198.96,59.03 204.65,53.34 LED27.4
G28
  Bottom 0.254: LED28.4 206.08,59.56 183.32,59.56 178.16,64.72 GREEN2.11
G29  (via drill 0.61)
  Top 0.254: v215.68,61.87 219.77,57.78 219.77,53.34 LED29.4
  Bottom 0.254: v215.68,61.87 211.05,66.5 182.25,66.5 180.65,64.9 GREEN2.12
G30
  Bottom 0.254: GREEN2.13 187.76,60.1 220.66,60.1 227.41,53.34 LED30.4
G31
  Bottom 0.254: GREEN2.14 185.63,64.72 189.36,60.98 227.41,60.98 235.06,53.34 LED31.4
G32
  Top 0.254: GREEN2.15 185.63,72.36 190.78,67.21 190.78,52.98 191.5,52.27 242.7,52.27 242.7,53.34 LED32.4
GND
  Top 0.254: R4.1 60.1,97.79 62.41,95.48 62.41,95.3 BLUE.22 62.59,95.12 66.5,91.21 66.5,78.41 67.39,77.52 C6.1 | R6.1 62.41,74.85 62.41,72.54 GREEN.22 62.59,72.36 63.48,71.48 63.48,56.01 61.35,53.87 61.35,47.47 62.41,46.41 62.41,38.23 R5.1 62.41,38.05 62.41,34.31 RED.22 63.48,33.25 63.48,24.36 | 63.48,24.36 51.03,24.36 41.97,15.29 35.92,15.29 C10.2 | R8.1 167.85,74.85 GREEN2.22 167.85,72.36 168.92,71.3 168.92,54.76 168.03,53.87 168.03,39.47 R7.1 167.85,39.29 RED2.22 167.85,35.2 164.29,31.65 164.29,26.14 | C7.1 172.83,77.52 172.83,80.72 169.27,84.28 169.27,93.7 167.85,95.12 BLUE2.22 167.26,95.83 166.78,95.83 165.35,97.27 R2.1 | X2.2 238.97,38.05 214.97,14.05 203.41,14.05 BATT3.N2 | 129.89,24.27 131.76,26.14 164.29,26.14 | 129.89,24.27 C3.1 | 164.29,26.14 164.29,25.6 184.21,25.6 195.76,14.05 BATT3.N1 | 63.48,24.36 129.8,24.36 129.89,24.27
  Bottom 0.254: C2.1 67.39,97.79 66.32,98.86 61.17,98.86 60.1,97.79 R4.1 | C6.1 65.08,75.03 62.59,75.03 R6.1 | C10.2 35.74,15.11 32.54,11.91 30.05,11.91 28.63,10.49 U$9.2 | C5.1 67.39,40.54 65.08,38.23 62.59,38.23 R5.1 | C1.1 172.83,97.79 171.76,98.86 166.43,98.86 R2.1 | C7.1 172.83,77.34 170.52,75.03 168.03,75.03 R8.1 | J2.20 138.69,71.12 139.22,70.59 166.07,70.59 167.85,72.36 GREEN2.22 | C8.1 172.83,41.78 170.52,39.47 168.03,39.47 R7.1
  Bottom 1.27: BATT3.N2 BATT3.N1 | C9.2 U$9.2 U$9.1
  pour Top (isolate 0.305): 21.88,101.52 198.61,101.52 arc-161 206.08,0 21.88,0 arc-93
N$1
  pour Bottom (isolate 0.305): 21.88,101.52 198.43,101.52 arc-161 206.08,0 21.88,0 arc-93
N$18
  Top 0.254: R2.2 170.52,97.79 172.83,95.48 172.83,95.3 BLUE2.20
N$21
  Bottom 1.27: BATT2.P1 BATT2.P2 BATT1.N2 BATT1.N1
N$22
  Bottom 1.27: BATT3.P1 BATT3.P2 BATT2.N2 BATT2.N1
N$58
  Top 0.254: R4.2 65.08,97.79 67.39,95.48 67.39,95.3 BLUE.20
N$77
  Top 0.254: R5.2 67.57,38.05 67.57,34.31 RED.20
N$96
  Top 0.254: R6.2 67.57,74.85 67.57,72.54 GREEN.20
N$115
  Top 0.254: R7.2 172.83,39.29 172.83,35.56 RED2.20
N$134
  Top 0.254: R8.2 172.83,74.85 172.83,72.54 GREEN2.20
P1.0/CS
  Top 0.254: J3.2 92.99,73.79 101.88,73.79 111.84,83.74 IC1.1
P1.1/SENSORDATA  (via drill 0.61)
  Top 0.254: v232.75,47.12 238.97,40.89 X2.3
  Bottom 0.254: v232.75,47.12 230.43,49.43 130.87,49.43 125.35,54.94 115.93,54.94 97.97,72.9 96.2,72.9 92.99,76.1 J3.3
P1.2/BLANK  (via drill 0.61)
  Top 0.254: 164.29,69.7 164.29,71.48 164.38,71.56 | 164.29,69.7 164.29,63.65 164.65,63.3 164.65,36.09 165.18,35.56 RED2.23 | 164.38,71.56 165.18,72.36 GREEN2.23 | BLUE2.23 164.29,94.23 164.29,71.65 164.38,71.56 | RED.23 59.75,34.31 58.86,35.2 58.86,66.14 59.75,67.03 59.75,72.36 GREEN.23 59.92,72.54 59.92,74.5 60.99,75.56 60.99,94.06 59.92,95.12 BLUE.23 | v164.65,69.7 164.29,69.7
  Bottom 0.254: GREEN.23 59.92,72.54 59.92,73.79 64.9,78.77 92.82,78.77 J3.4 92.99,78.59 101.71,69.88 164.47,69.88 v164.65,69.7
P1.3/VPRG
  Top 0.254: RED2.27 155.22,35.56 156.29,36.63 156.29,71.3 155.22,72.36 GREEN2.27 155.05,72.54 155.05,80.37 154.16,81.25 154.16,94.23 155.05,95.12 BLUE2.27 | RED.27 49.79,34.31 50.86,35.38 50.86,71.3 49.79,72.36 GREEN.27 49.61,72.54 48.72,73.43 48.72,94.23 BLUE.27
  Bottom 0.254: GREEN.27 49.79,72.54 56.55,79.3 90.86,79.3 92.82,81.25 J3.5 92.99,81.25 99.22,75.03 138.87,75.03 139.22,74.68 152.91,74.68 155.05,72.54 GREEN2.27
P1.4/GSCLK
  Top 0.254: 178.96,71.56 178.16,72.36 GREEN2.18 | 178.96,71.56 179.05,71.48 179.05,63.65 178.87,63.48 178.87,36.27 178.16,35.56 RED2.18 | BLUE2.18 178.16,95.12 179.05,94.23 179.05,71.65 178.96,71.56 | RED.18 72.73,34.31 73.61,35.2 73.61,71.48 72.73,72.36 GREEN.18 72.55,72.54 71.48,73.61 71.48,94.06 72.55,95.12 BLUE.18 72.73,95.3 72.73,96.9 80.73,96.9 81.26,96.37 81.26,95.48 J3.6
  Bottom 0.254: RED2.18 177.98,35.56 176.21,33.78 127.49,33.78 116.64,44.63 83.04,44.63 72.73,34.31 RED.18
P1.5/UCB0CLK
  Bottom 0.254: IC1.6 119.49,78.77 118.06,80.19 101,80.19 94.95,86.23 92.99,86.23 J3.7
P1.6/UCB0SOMI
  Bottom 0.254: J2.14 134.96,82.68 113.26,82.68 112.02,81.43 IC1.2
P1.7/UCB0SIMO
  Bottom 0.254: J2.15 138.51,83.74 137.44,82.68 137.44,78.41 136.2,77.17 120.55,77.17 IC1.5
P2.0/SCLK
  Top 0.254: GREEN2.25 159.23,71.39 | 159.23,71.39 159.14,71.3 159.14,63.65 160.03,62.76 160.03,35.74 160.2,35.56 RED2.25 | 159.14,93.52 159.14,71.48 159.23,71.39 | 159.14,93.52 159.14,94.06 160.2,95.12 BLUE2.25 | 55.75,71.56 54.95,72.36 GREEN.25 | 55.75,71.56 55.83,71.48 55.83,63.48 56.01,63.3 56.01,35.38 54.95,34.31 RED.25 | BLUE.25 55.83,94.23 55.83,71.65 55.75,71.56 | 159.14,93.52 156.29,93.52 156.29,96.19 155.58,96.9 94.59,96.9 94.59,90.5 92.99,88.9 J3.8
  Bottom 0.254: BLUE.25 57.61,92.46 89.26,92.46 92.82,88.9 J3.8
P2.1/XLAT
  Top 0.254: 161.71,71.39 162.69,72.36 GREEN2.24 | 161.71,71.39 161.63,71.3 161.63,63.83 162.69,62.76 162.69,35.56 RED2.24 | 161.71,71.39 161.63,71.48 161.63,94.06 162.69,95.12 BLUE2.24 162.51,95.12 160.2,97.43 94.06,97.43 94.06,92.63 92.99,91.57 J3.9 | 56.46,71.56 57.26,72.36 GREEN.24 | 56.46,71.56 56.37,71.48 56.37,63.65 56.55,63.48 56.55,35.03 57.26,34.31 RED.24 | BLUE.24 57.26,95.12 56.37,94.23 56.37,71.65 56.46,71.56
  Bottom 0.254: J3.9 92.82,91.57 91.39,92.99 59.57,92.99 57.43,95.12 BLUE.24
P2.2/SIN1
  Top 0.254: GREEN.26 52.28,72.54 53.7,73.97 53.7,96.37 56.37,99.03 92.82,99.03 92.82,94.06 J3.10
P2.3/SIN2
  Bottom 0.254: GREEN2.26 157.71,72.54 157.71,84.28 158.96,84.28 161.27,86.59 161.27,96.9 141.53,96.9 138.69,94.06 J2.11
P2.4/SIN3  (via drill 0.61)
  Top 0.254: v121.98,32.54 134.96,45.52 134.96,87.83 138.51,91.39 J2.12
  Bottom 0.254: v121.98,32.54 53.88,32.54 52.28,34.14 RED.26
P2.5/SIN4
  Top 0.254: RED2.26 157.54,35.56 155.76,33.78 153.62,33.78 153.62,46.94 152.38,48.18 152.38,48.72 148.82,52.27 144.91,52.27 144.91,82.68 138.69,88.9 J2.13
R1  (via drill 0.61)
  Top 0.254: v33.43,34.31 21.16,46.58 6.58,46.58 6.58,48.18 LED1.3
  Bottom 0.254: v33.43,34.31 47.12,34.31 RED.28
R2
  Top 0.254: RED.1 47.12,26.67 26.68,47.12 14.23,47.12 14.23,48.18 LED2.3
R3
  Top 0.254: RED.2 49.61,26.67 48.72,27.56 48.72,45.16 45.7,48.18 45.7,48.72 44.99,49.43 21.87,49.43 21.87,48.36 LED3.3
R4  (via drill 0.61)
  Top 0.254: v46.77,30.94 29.52,48.18 LED4.3
  Bottom 0.254: RED.3 48.01,30.94 v46.77,30.94
R5  (via drill 0.61)
  Top 0.254: v47.12,32.18 37.17,42.14 37.17,48.18 LED5.3
  Bottom 0.254: v47.12,32.18 49.26,32.18 54.77,26.67 RED.4
R6
  Top 0.254: RED.5 57.26,26.67 55.48,24.89 48.19,24.89 48.19,44.81 44.81,48.18 LED6.3
R7
  Top 0.254: RED.6 59.75,26.67 53.35,33.07 53.35,47.12 52.28,48.18 LED7.3
R8
  Top 0.254: RED.7 62.41,26.67 60.99,28.09 60.99,47.12 59.92,48.18 LED8.3
R9
  Top 0.254: RED.8 65.08,26.67 66.32,27.91 66.32,47.12 67.39,48.18 LED9.3
R10
  Top 0.254: RED.9 67.57,26.67 74.15,33.25 74.15,47.3 75.04,48.18 LED10.3
R11
  Top 0.254: RED.10 70.95,27.56 70.95,27.91 76.64,33.6 76.64,42.14 LED11.3
R12
  Top 0.254: RED.11 72.73,26.67 78.06,32 90.33,32 90.33,48.18 LED12.3
R13
  Top 0.254: RED.12 75.04,26.67 73.26,24.89 71.48,24.89 71.48,27.74 76.28,32.54 89.26,32.54 89.26,48.72 89.97,49.43 97.97,49.43 97.97,48.36 LED13.3
R14
  Top 0.254: LED14.3 105.62,31.47 82.5,31.47 77.7,26.67 RED.13
R15
  Top 0.254: RED.14 113.09,26.67 113.09,48.18 LED15.3
R16  (via drill 0.61)
  Top 0.254: v116.29,43.74 120.73,48.18 LED16.3
  Bottom 0.254: v116.29,43.74 89.79,43.74 80.37,34.31 RED.15
R17  (via drill 0.61)
  Top 0.254: LED17.3 v132.47,44.27
  Bottom 0.254: v132.47,44.27 143.85,44.27 152.56,35.56 RED2.28
R18
  Top 0.254: RED2.1 152.56,28.09 136.2,44.45 136.2,48.18 LED18.3
R19
  Top 0.254: RED2.2 155.05,28.09 143.85,39.29 143.85,48.18 LED19.3
R20
  Top 0.254: RED2.3 151.49,34.14 151.49,48.18 LED20.3
R21
  Top 0.254: LED21.3 158.96,29.34 160.2,28.09 RED2.4
R22
  Top 0.254: RED2.5 162.87,28.09 163.76,28.98 163.76,31.83 166.43,34.49 166.43,48.18 LED22.3
R23
  Top 0.254: RED2.6 165.36,28.09 171.76,34.49 171.76,45.87 174.07,48.18 LED23.3
R24
  Top 0.254: RED2.7 167.85,27.91 169.63,26.14 176.92,26.14 176.92,29.69 181.72,34.49 181.72,48.18 LED24.3
R25
  Top 0.254: RED2.8 170.52,28.09 176.21,33.78 179.41,33.78 179.41,47.47 181.36,49.43 189.36,49.43 189.36,48.36 LED25.3
R26  (via drill 0.61)
  Top 0.254: v185.63,33.43 197.01,44.81 197.01,48.18 LED26.3
  Bottom 0.254: v185.63,33.43 178.34,33.43 173,28.09 RED2.9
R27  (via drill 0.61)
  Top 0.254: v190.78,32 204.65,45.87 204.65,48.18 LED27.3
  Bottom 0.254: v190.78,32 179.41,32 175.49,28.09 RED2.10
R28  (via drill 0.61)
  Top 0.254: v207.85,43.74 212.3,48.18 LED28.3
  Bottom 0.254: RED2.11 180.29,30.23 194.34,30.23 v207.85,43.74
R29  (via drill 0.61)
  Top 0.254: v201.27,29.69 219.77,48.18 LED29.3
  Bottom 0.254: v201.27,29.69 182.25,29.69 180.65,28.09 RED2.12
R30  (via drill 0.61)
  Top 0.254: v205.36,26.14 227.41,48.18 LED30.3
  Bottom 0.254: v205.36,26.14 184.92,26.14 183.14,27.91 RED2.13
R31
  Top 0.254: RED2.14 185.63,28.09 203.59,46.05 203.59,48.72 204.3,49.43 235.06,49.43 235.06,48.36 LED31.3
R32
  Bottom 0.254: RED2.15 194.7,44.63 240.57,44.63 242.7,46.76 242.7,48.18 LED32.3
VCC
  Bottom 1.27: C9.1 U$9.3 U$9.4 39.58,10.16 BATT1.P2 BATT1.P1 56.09,19.05 124.67,19.05 | C3.2 124.67,19.05 | X2.1 222.46,19.05 124.67,19.05
XIN/P2.6/SIN5  (via drill 0.61)
  Top 0.254: v135.84,78.05 137.44,76.45 137.44,74.85 J2.19
  Bottom 0.254: BLUE.26 52.28,95.12 57.97,89.43 88.19,89.43 92.64,84.99 95.48,84.99 102.77,77.7 135.49,77.7 v135.84,78.05
XOUT/P2.7/SIN6
  Bottom 0.254: BLUE2.26 157.54,95.12 138.69,76.28 J2.18

### Text on the board
_tsilk: R2 | C1 | 0.1uF | R4 | 0.1uF | C2 | 2.2K | 2.2K | BLUE2 | BLUE | IC1 | 25AA080P | C6 | 0.1uF | C7 | R6 | R8 | 2.2K | 2.2K | 0.1uF | GREEN2 | GREEN | LED13 | LED20 | LED21 | LED22 | LED24 | LED8 | LED10 | LED7 | LED11 | LED12 | LED18 | LED23 | LED25 | LED1 | LED2 | LED3 | LED4 | LED5 | LED6 | LED9 | LED14 | LED15 | LED16 | LED17 | LED19 | LED26 | LED27 | LED28 | LED29 | LED30 | LED31 | LED32 | C8 | C5 | R7 | 0.1uF | R5 | 0.1uF | 2.2K | 2.2K | X2 | RED2 | RED | 0.1uF | C3 | C10 | 10uF | C9 | 0.1uF | Netscher, Bartling, LaBounta | RGB Bike POV | TI Intern Design Challenge 2012
_bsilk: 11 | 10 | J2 | J3 | 1 | 20 | AA 1.5V | AA 1.5V | AA 1.5V